# Altium schematic sheet Power Supply.SchDoc
size A4; SheetNumber: 5; SheetTotal: 5
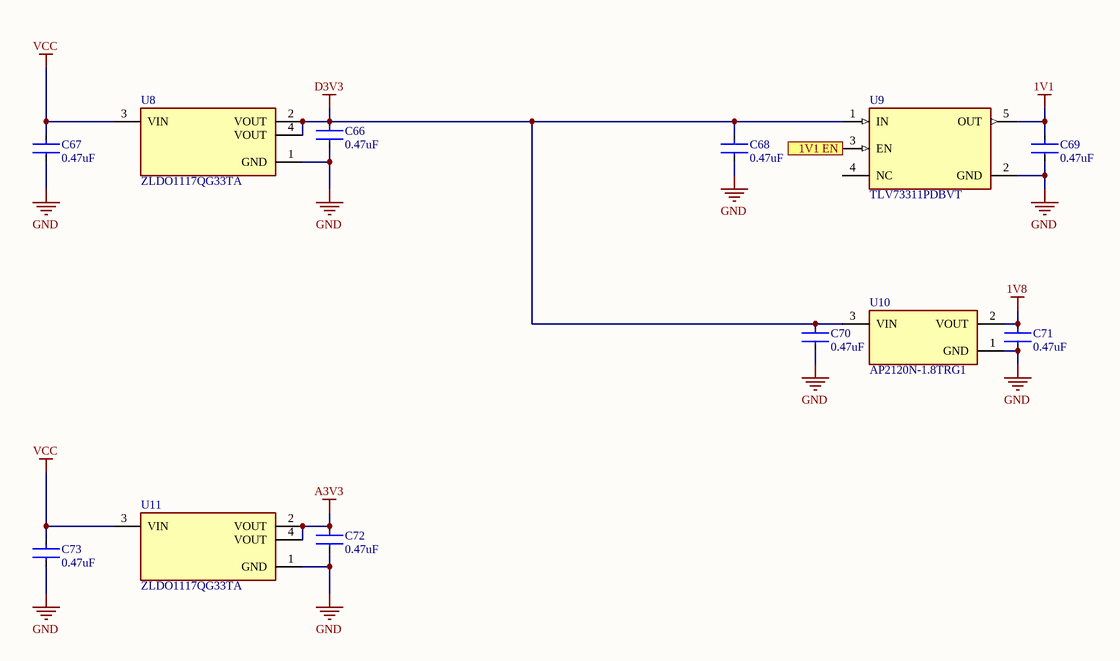
[diagram p0: Power Supply.SchDoc]

## Parts
C66  0.47uF  [FP-GRM15-MFG]
C67  0.47uF  [FP-GRM15-MFG]
C68  0.47uF  [FP-GRM15-MFG]
C69  0.47uF  [FP-GRM15-MFG]
C70  0.47uF  [FP-GRM15-MFG]
C71  0.47uF  [FP-GRM15-MFG]
C72  0.47uF  [FP-GRM15-MFG]
C73  0.47uF  [FP-GRM15-MFG]
U8  ZLDO1117QG33TA  [FP-SOT223-MFG]
U9  TLV73311PDBVT  [FP-DBV0005A-IPC_C]
U10  AP2120N-1.8TRG1  [FP-SOT23-IPC_A]
U11  ZLDO1117QG33TA  [FP-SOT223-MFG]

## Ports
1V1 EN (in)

## Nets
1V1: C69.2 U9.5(OUT)
1V8: C71.2 U10.2(VOUT)
A3V3: C72.2 U11.2(VOUT) U11.4(VOUT)
D3V3: C66.2 C68.2 C70.2 U8.2(VOUT) U8.4(VOUT) U9.1(IN) U10.3(VIN)
GND: C66.1 C67.1 C68.1 C69.1 C70.1 C71.1 C72.1 C73.1 U8.1(GND) U9.2(GND) U10.1(GND) U11.1(GND)
VCC: C67.2 C73.2 U8.3(VIN) U11.3(VIN)
1V1 EN: U9.3(EN) ; port 1V1 EN

Not connected (* = marked no-connect by the designer): U9 4(NC)

## Library data of the parts
C66-C73 = CMP-2100-03641-2: CAP CER 0.1UF 16V X7R 0402; Manufacturer Part Number: GRM155R71C104KA88D; Manufacturer: Murata; Standoff Height: 0mm; Tolerance: 10%; Description: CAP Ceramic 0.10μF 10% X7R 16Vdc 0402 SMD; Voltage Rating: 16Vdc; Material: Ceramic; Capacitance: 0.10μF; Value: 0.10μF; RoHS: TRUE; Temperature Characteristic: X7R; Octopart: https://octopart.com/grm155r71c104ka88d-murata-196880; Digikey Description: CAP CER 0.1UF 16V X7R 0402; Device Class L3: Ceramic Capacitors; Height: 0.55mm; ComponentLink2Description: Datasheet; Temperature Range Low: -55°C; Ipc Land Pattern Name: CAPC10050X219; ComponentLink2URL: https://search.murata.co.jp/Ceramy/image/img/A01X/G101/ENG/GRM155R71H471KA01-01A.pdf; Device Class L1: Passive Components; Lead Free: yes; Category: Cap; Package: GRM15; Temperature: -55°C to +125°C; Device Class L2: Capacitors; Temperature Range High: +125°C; Mouser Description: 0402 0.1 uF 16V ±10 % Tolerance X7R SMT Multilayer Ceramic Capacitor
U8 U11 = CMP-12756-000030-1: IC REG LINEAR 3.3V 1A SOT223-3; Dropout Voltage: 1.11V; Power Dissipation: 15W; Output Voltage Accuracy: 2%; Max Input Voltage: 18V; Output Type: Fixed; Number of Regulators: 1; Min Input Voltage: 2.7V; Min Current Limit: 1.1A; Quiescent Current: 10mA; Polarity: Positive; Length: 6.7mm; Min Operating Temperature: -40°C; Max Output Current: 1A; Min Output Voltage: 3.3V; Width: 3.7mm; Reference Voltage: 3.3V; Number of Pins: 3; Package Quantity: 1000; Tolerance: 2%; Max Operating Temperature: 125°C; Output Voltage: 3.3V; Accuracy: 2%; Case/Package: SOT-223; Lead Free: Lead Free; Radiation Hardening: No; Output Current: 1A; Number of Outputs: 1; Packaging: Tape and Reel; REACH SVHC: No SVHC; Max Power Dissipation: 15W; Height: 1.7mm; Mount: Surface Mount; Weight: 0.000282oz; Nominal Output Voltage: 3.3V
U9 = CMP-04917-000285-1: IC REG LINEAR 1.1V 300MA SOT23-5; Polarity: Positive; Number of Regulators: 1; Power Supply Rejection Ratio (PSRR): 68dB; Output Type: Fixed; Accuracy: 1%; Operating Supply Current: 34uA; Min Current Limit: 360mA; Quiescent Current: 60uA; Max Input Voltage: 5.5V; Min Input Voltage: 1.4V; Dropout Voltage: 460mV; Number of Pins: 5; Packaging: Tape and Reel; Max Output Current: 300mA; Mount: Surface Mount; Nominal Output Voltage: 1.1V; Output Voltage: 1.1V; REACH SVHC: No SVHC; RoHS Compliant: Yes; Output Current: 300mA; Lead Free: Lead Free; Weight: 0.000557oz; Package Quantity: 250; Min Operating Temperature: -40°C; Max Operating Temperature: 125°C; Number of Outputs: 1; Case/Package: SOT-23-5
U10 = CMP-12756-000031-1: IC REG LINEAR 1.8V 150MA SOT23; Quiescent Current: 50uA; Max Input Voltage: 6V; Accuracy: 2%; Power Supply Rejection Ratio (PSRR): 65dB; Number of Outputs: 1; Min Input Voltage: 2V; Polarity: Positive; Operating Supply Current: 25uA; Dropout Voltage: 300mV; Output Type: Fixed; Mount: Surface Mount; Packaging: Tape and Reel; Package Quantity: 3000; Weight: 0.000282oz; Lead Free: Lead Free; Width: 1.4mm; Height: 1.1mm; Length: 3mm; Output Current: 150mA; Case/Package: SOT-23; Number of Pins: 3; Max Operating Temperature: 85°C; Max Output Current: 150mA; Output Voltage: 1.8V; Number of Regulators: 1; Min Operating Temperature: -40°C